# Altium schematic sheet clock-top.SchDoc
size Letter; CheckedBy: E. Chiu; CompanyName: Brinton Engineering, LLC; DrawnBy: J. Brinton; Engineer: J. Brinton; Address1: 3479 Edison Way; Address2: Menlo Park CA 94025; Address3: +1 (877) 778-8435; Address4: brintonengineering.com; Revision: 1; SheetNumber: 42; SheetTotal: 48
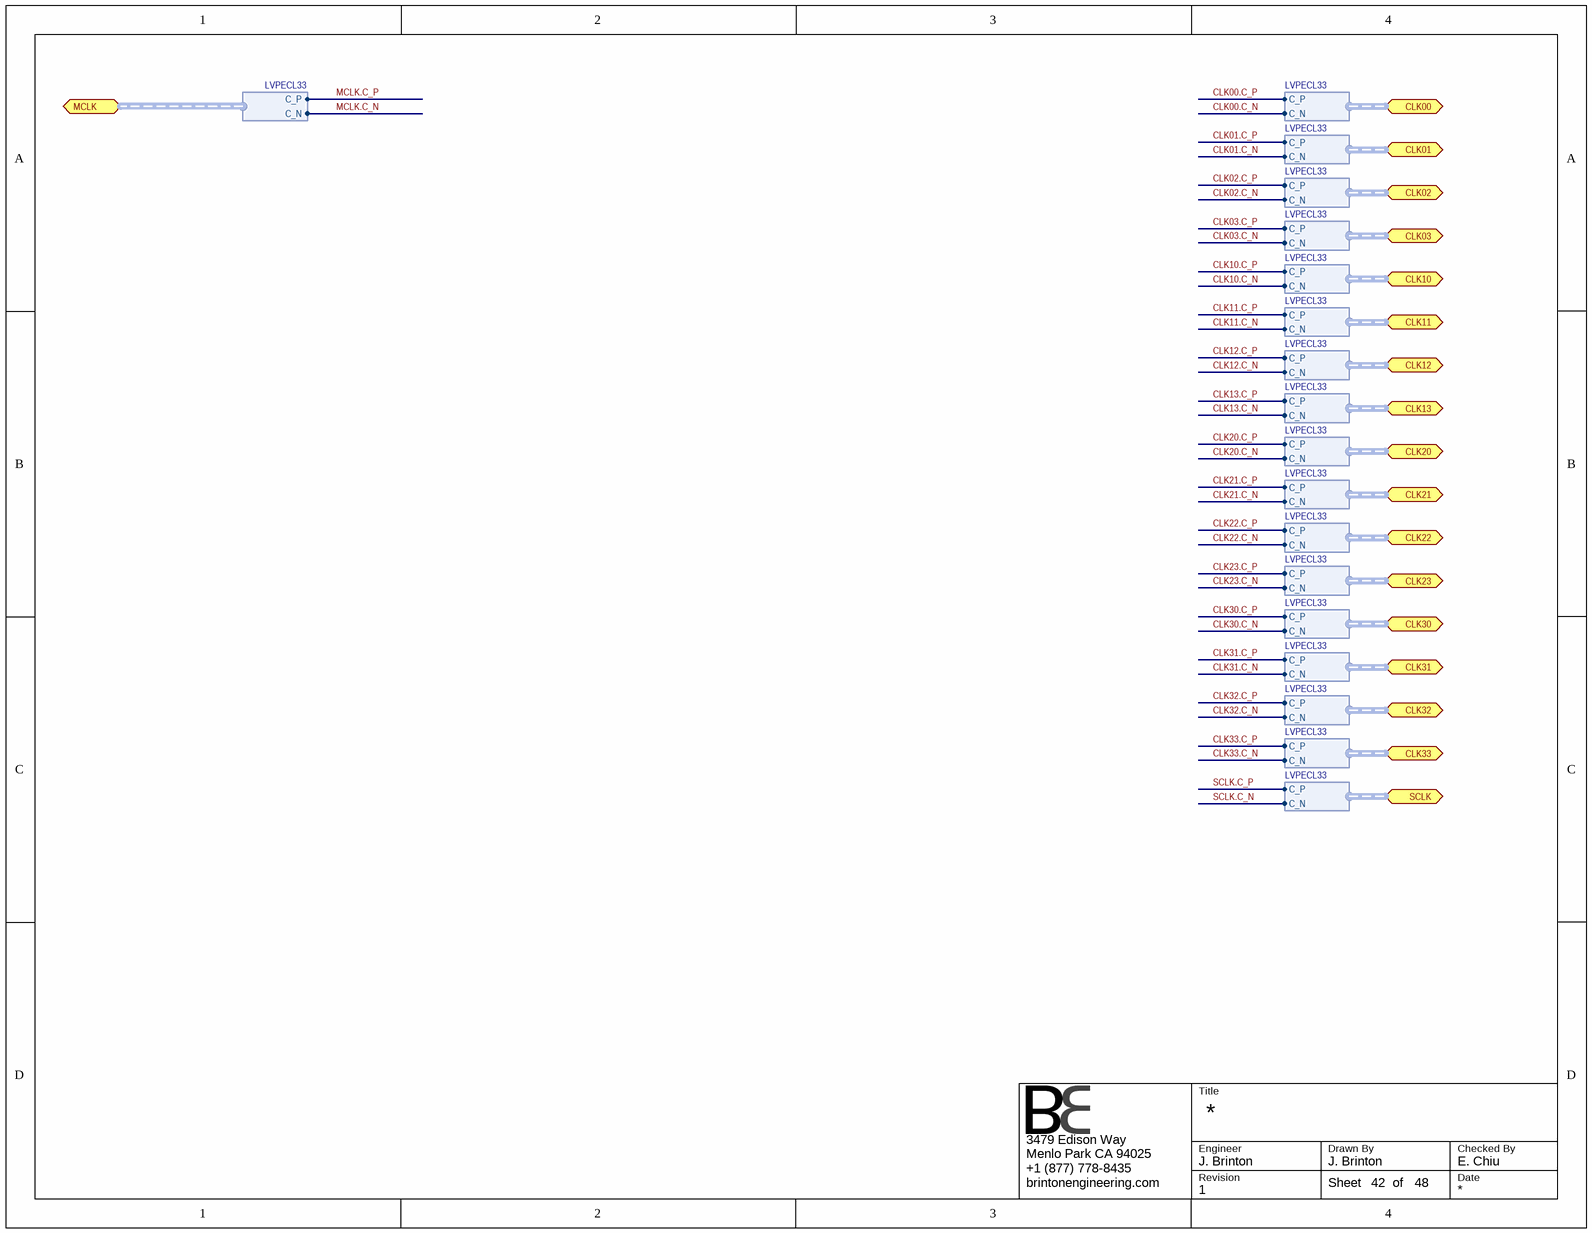
[diagram p0: clock-top.SchDoc]

## Ports
CLK00 (harness LVPECL33), CLK01 (harness LVPECL33), CLK02 (harness LVPECL33), CLK03 (harness LVPECL33), CLK10 (harness LVPECL33), CLK11 (harness LVPECL33), CLK12 (harness LVPECL33), CLK13 (harness LVPECL33), CLK20 (harness LVPECL33), CLK21 (harness LVPECL33), CLK22 (harness LVPECL33), CLK23 (harness LVPECL33), CLK30 (harness LVPECL33), CLK31 (harness LVPECL33), CLK32 (harness LVPECL33), CLK33 (harness LVPECL33), MCLK (harness LVPECL33), SCLK (harness LVPECL33)

## Harnesses
LVPECL33: C_P, C_N

## Nets
CLK00.C_N: port CLK00.C_N
CLK00.C_P: port CLK00.C_P
CLK01.C_N: port CLK01.C_N
CLK01.C_P: port CLK01.C_P
CLK02.C_N: port CLK02.C_N
CLK02.C_P: port CLK02.C_P
CLK03.C_N: port CLK03.C_N
CLK03.C_P: port CLK03.C_P
CLK10.C_N: port CLK10.C_N
CLK10.C_P: port CLK10.C_P
CLK11.C_N: port CLK11.C_N
CLK11.C_P: port CLK11.C_P
CLK12.C_N: port CLK12.C_N
CLK12.C_P: port CLK12.C_P
CLK13.C_N: port CLK13.C_N
CLK13.C_P: port CLK13.C_P
CLK20.C_N: port CLK20.C_N
CLK20.C_P: port CLK20.C_P
CLK21.C_N: port CLK21.C_N
CLK21.C_P: port CLK21.C_P
CLK22.C_N: port CLK22.C_N
CLK22.C_P: port CLK22.C_P
CLK23.C_N: port CLK23.C_N
CLK23.C_P: port CLK23.C_P
CLK30.C_N: port CLK30.C_N
CLK30.C_P: port CLK30.C_P
CLK31.C_N: port CLK31.C_N
CLK31.C_P: port CLK31.C_P
CLK32.C_N: port CLK32.C_N
CLK32.C_P: port CLK32.C_P
CLK33.C_N: port CLK33.C_N
CLK33.C_P: port CLK33.C_P
MCLK.C_N: port MCLK.C_N
MCLK.C_P: port MCLK.C_P
SCLK.C_N: port SCLK.C_N
SCLK.C_P: port SCLK.C_P

## Notes on the sheet
- Title
- Engineer
- Revision
- Drawn By
- Checked By
- Date
- Sheet
- of